# EAGLE schematic socialCAN_demo (EAGLE 9.6.2)
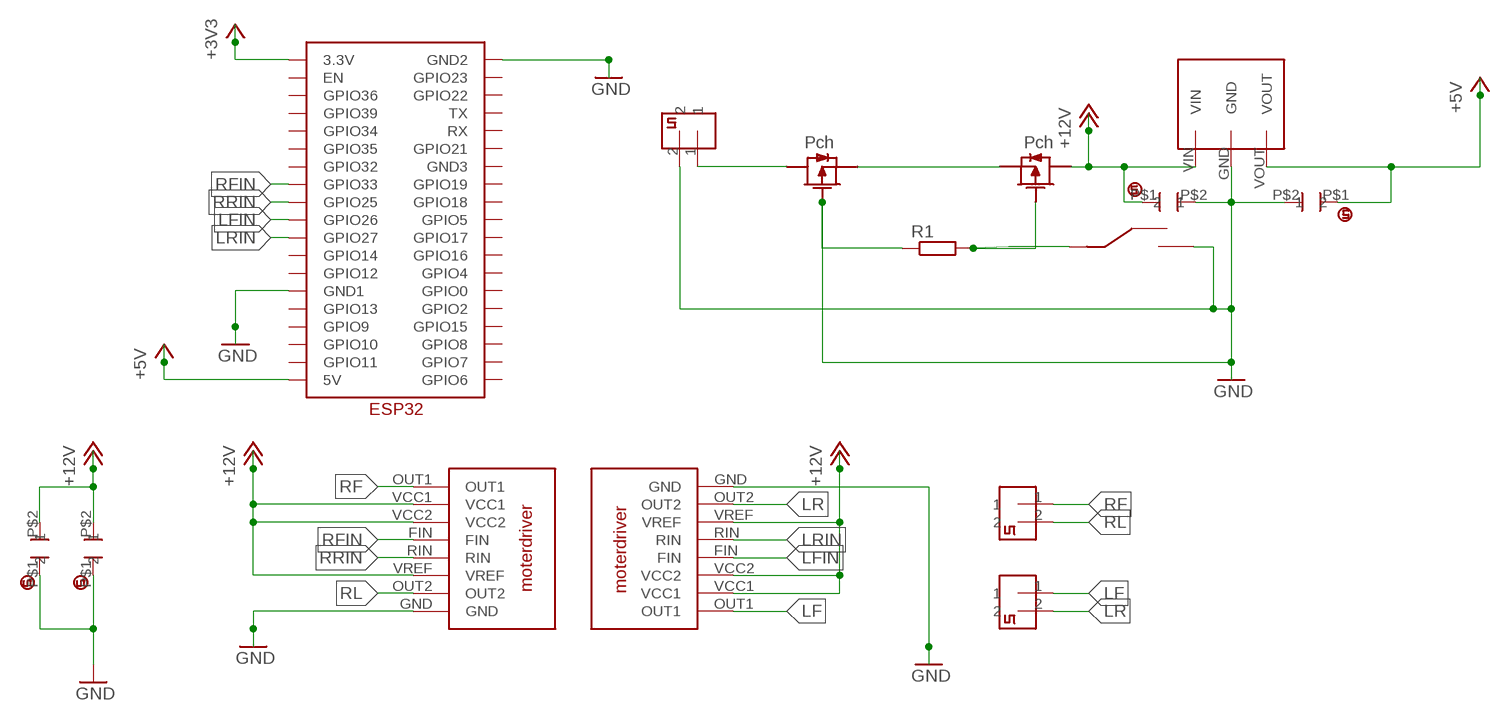
[diagram p0: schematic, sheet 1]

## Parts
CERAMIC_CAPACITOR1  CERAMIC_CAPACITOR  [CERAMIC_CAPACITOR]
CERAMIC_CAPACITOR2  CERAMIC_CAPACITOR  [CERAMIC_CAPACITOR]
CERAMIC_CAPACITOR3  CERAMIC_CAPACITOR  [CERAMIC_CAPACITOR]
CERAMIC_CAPACITOR4  CERAMIC_CAPACITOR  [CERAMIC_CAPACITOR]
CONNECTOR1  2PIN  [2PIN]
CONNECTOR2  2PIN  [2PIN]
CONNECTOR3  2PIN  [2PIN]
R1  R-EU_0207/10  [0207/10]
U$1  2SJ681-PCH  [2SJ681]
U$4  ESP32  [ESP32]
U$5  2SJ681-PCH  [2SJ681]
U$6  M78AR05-1  [M78AR05-1]
U$8  SLIDESWITCH  [SLIDESWITCH]
U$15  MOTORDRIVER  [MOTORDRIVER]
U$16  MOTORDRIVER  [MOTORDRIVER]

## Nets
+3V3: U$4.3.3V
+5V: CERAMIC_CAPACITOR1.P$1 U$4.5V U$6.VOUT
+12V: CERAMIC_CAPACITOR2.P$1 CERAMIC_CAPACITOR3.P$2 CERAMIC_CAPACITOR4.P$2 U$5.DRAIN U$6.VIN U$15.VCC1 U$15.VCC2 U$15.VREF U$16.VCC1 U$16.VCC2 U$16.VREF
GND: CERAMIC_CAPACITOR1.P$2 CERAMIC_CAPACITOR2.P$2 CERAMIC_CAPACITOR3.P$1 CERAMIC_CAPACITOR4.P$1 CONNECTOR2.2 R1.1 U$1.GATE U$4.GND1 U$6.GND U$8.C U$15.GND U$16.GND
LF: CONNECTOR3.1 U$16.OUT1
LFIN: U$4.GPIO26 U$16.FIN
LR: CONNECTOR3.2 U$16.OUT2
LRIN: U$4.GPIO27 U$16.RIN
N$1: U$4.GND2 ; supply symbol labelled GND
N$2: U$1.SOURCE U$5.SOURCE
N$3: R1.2 U$5.GATE U$8.A
N$6: CONNECTOR2.1 U$1.DRAIN
RF: CONNECTOR1.1 U$15.OUT1
RFIN: U$4.GPIO33 U$15.FIN
RL: CONNECTOR1.2 U$15.OUT2
RRIN: U$4.GPIO25 U$15.RIN
Unconnected: U$4.EN U$4.GND3 U$4.GPIO0 U$4.GPIO2 U$4.GPIO4 U$4.GPIO5 U$4.GPIO6 U$4.GPIO7 U$4.GPIO8 U$4.GPIO9 U$4.GPIO10 U$4.GPIO11 U$4.GPIO12 U$4.GPIO13 U$4.GPIO14 U$4.GPIO15 U$4.GPIO16 U$4.GPIO17 U$4.GPIO18 U$4.GPIO19 U$4.GPIO21 U$4.GPIO22 U$4.GPIO23 U$4.GPIO32 U$4.GPIO34 U$4.GPIO35 U$4.GPIO36 U$4.GPIO39 U$4.RX U$4.TX U$8.B

## Library data of the parts
CERAMIC_CAPACITOR1-CERAMIC_CAPACITOR4 = capacitor:CERAMIC_CAPACITOR: ceramic_capacitor
CONNECTOR1-CONNECTOR3 = 2pin_small:2PIN: 2pin
R1 = rcl:R-EU_: RESISTOR, European symbol; SPICEPREFIX: R
U$1 U$5 = MOSFET:2SJ681-PCH
U$4 = ESP32:ESP32
U$6 = M78AR05-1:M78AR05-1
U$8 = SLIDESWITCH:SLIDESWITCH
U$15 U$16 = motordriver:MOTORDRIVER